# EAGLE design esquematico (EAGLE 9.6.2)
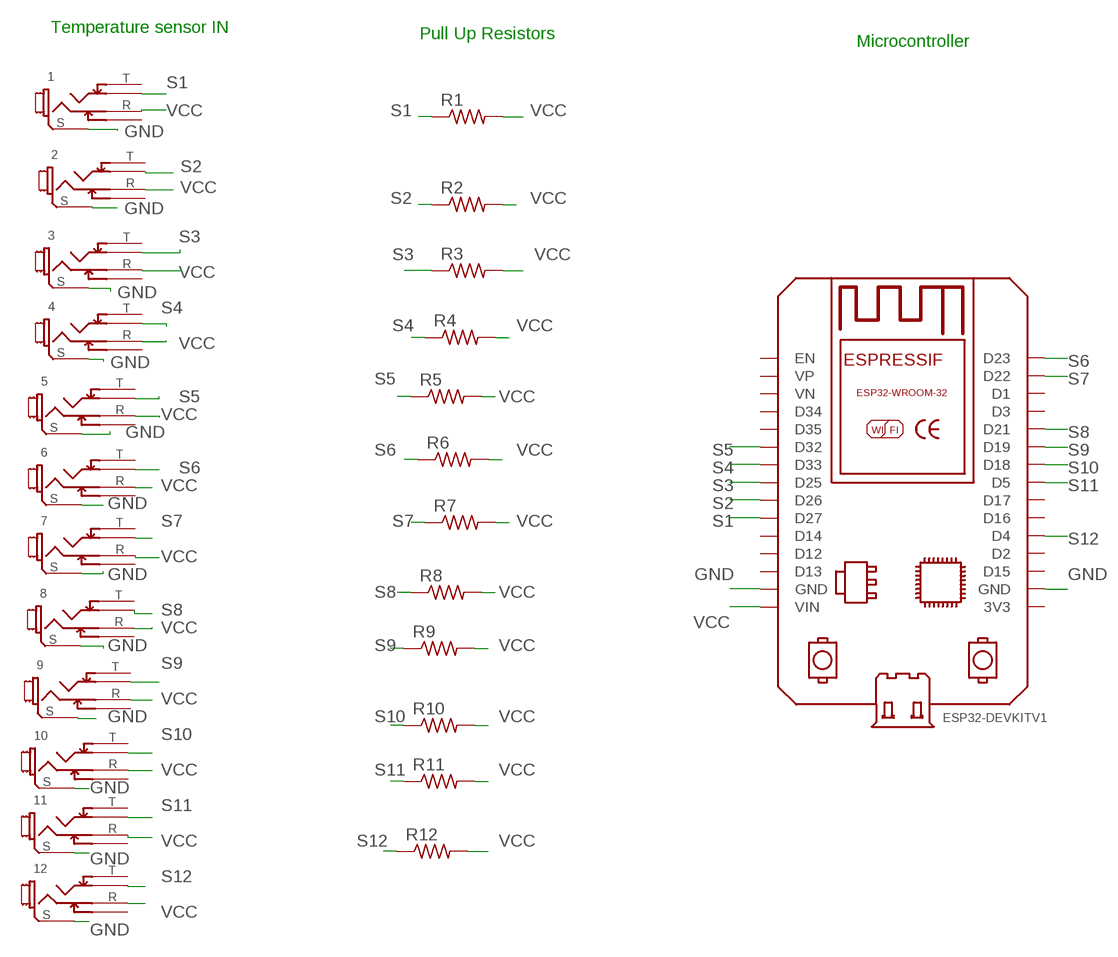
[diagram p0: schematic, sheet 1]

## Parts
1  JACK-3.5MM  [JACK-5PINES]
2  JACK-3.5MM  [JACK-5PINES]
3  JACK-3.5MM  [JACK-5PINES]
4  JACK-3.5MM  [JACK-5PINES]
5  JACK-3.5MM  [JACK-5PINES]
6  JACK-3.5MM  [JACK-5PINES]
7  JACK-3.5MM  [JACK-5PINES]
8  JACK-3.5MM  [JACK-5PINES]
9  JACK-3.5MM  [JACK-5PINES]
10  JACK-3.5MM  [JACK-5PINES]
11  JACK-3.5MM  [JACK-5PINES]
12  JACK-3.5MM  [JACK-5PINES]
BOARD1  ESP32DEVKITV1  [ESP32-DEVKITV1]
R1  R-US_M0805  [M0805]
R2  R-US_M0805  [M0805]
R3  R-US_M0805  [M0805]
R4  R-US_M0805  [M0805]
R5  R-US_M0805  [M0805]
R6  R-US_M0805  [M0805]
R7  R-US_M0805  [M0805]
R8  R-US_M0805  [M0805]
R9  R-US_M0805  [M0805]
R10  R-US_M0805  [M0805]
R11  R-US_M0805  [M0805]
R12  R-US_M0805  [M0805]

## Nets
GND: 1.S 2.S 3.S 4.S 5.S 6.S 7.S 8.S 9.S 10.S 11.S 12.S BOARD1.GND BOARD1.GND@1(GND)
S1: 1.T BOARD1.D27 R1.1
S2: 2.T BOARD1.D26 R2.1
S3: 3.T BOARD1.D25 R3.1
S4: 4.T BOARD1.D33 R4.1
S5: 5.T BOARD1.D32 R5.1
S6: 6.T BOARD1.D23 R6.1
S7: 7.T BOARD1.D22 R7.1
S8: 8.T BOARD1.D21 R8.1
S9: 9.T BOARD1.D19 R9.1
S10: 10.T BOARD1.D18 R10.1
S11: 11.T BOARD1.D5 R11.1
S12: 12.T BOARD1.D4 R12.1
VCC: 1.R 2.R 3.R 4.R 5.R 6.R 7.R 8.R 9.R 10.R 11.R 12.R BOARD1.VIN R1.2 R2.2 R3.2 R4.2 R5.2 R6.2 R7.2 R8.2 R9.2 R10.2 R11.2 R12.2
Unconnected: 1.RS 1.TS 2.RS 2.TS 3.RS 3.TS 4.RS 4.TS 5.RS 5.TS 6.RS 6.TS 7.RS 7.TS 8.RS 8.TS 9.RS 9.TS 10.RS 10.TS 11.RS 11.TS 12.RS 12.TS BOARD1.3V3 BOARD1.D1 BOARD1.D2 BOARD1.D3 BOARD1.D12 BOARD1.D13 BOARD1.D14 BOARD1.D15 BOARD1.D16 BOARD1.D17 BOARD1.D34 BOARD1.D35 BOARD1.EN BOARD1.VN BOARD1.VP

## Notes on the sheet
- Temperature sensor IN
- Pull Up Resistors
- Microcontroller

## Library data of the parts
1-12 = MCE_Conectores:JACK-3.5MM: Jack para audio 3.5mm / 5 pines para PCB
BOARD1 = ESP32-DEVKITV1:ESP32DEVKITV1: https://github.com/shridattdudhat
R1-R12 = rcl:R-US_: RESISTOR, American symbol; SPICEPREFIX: R

## Board
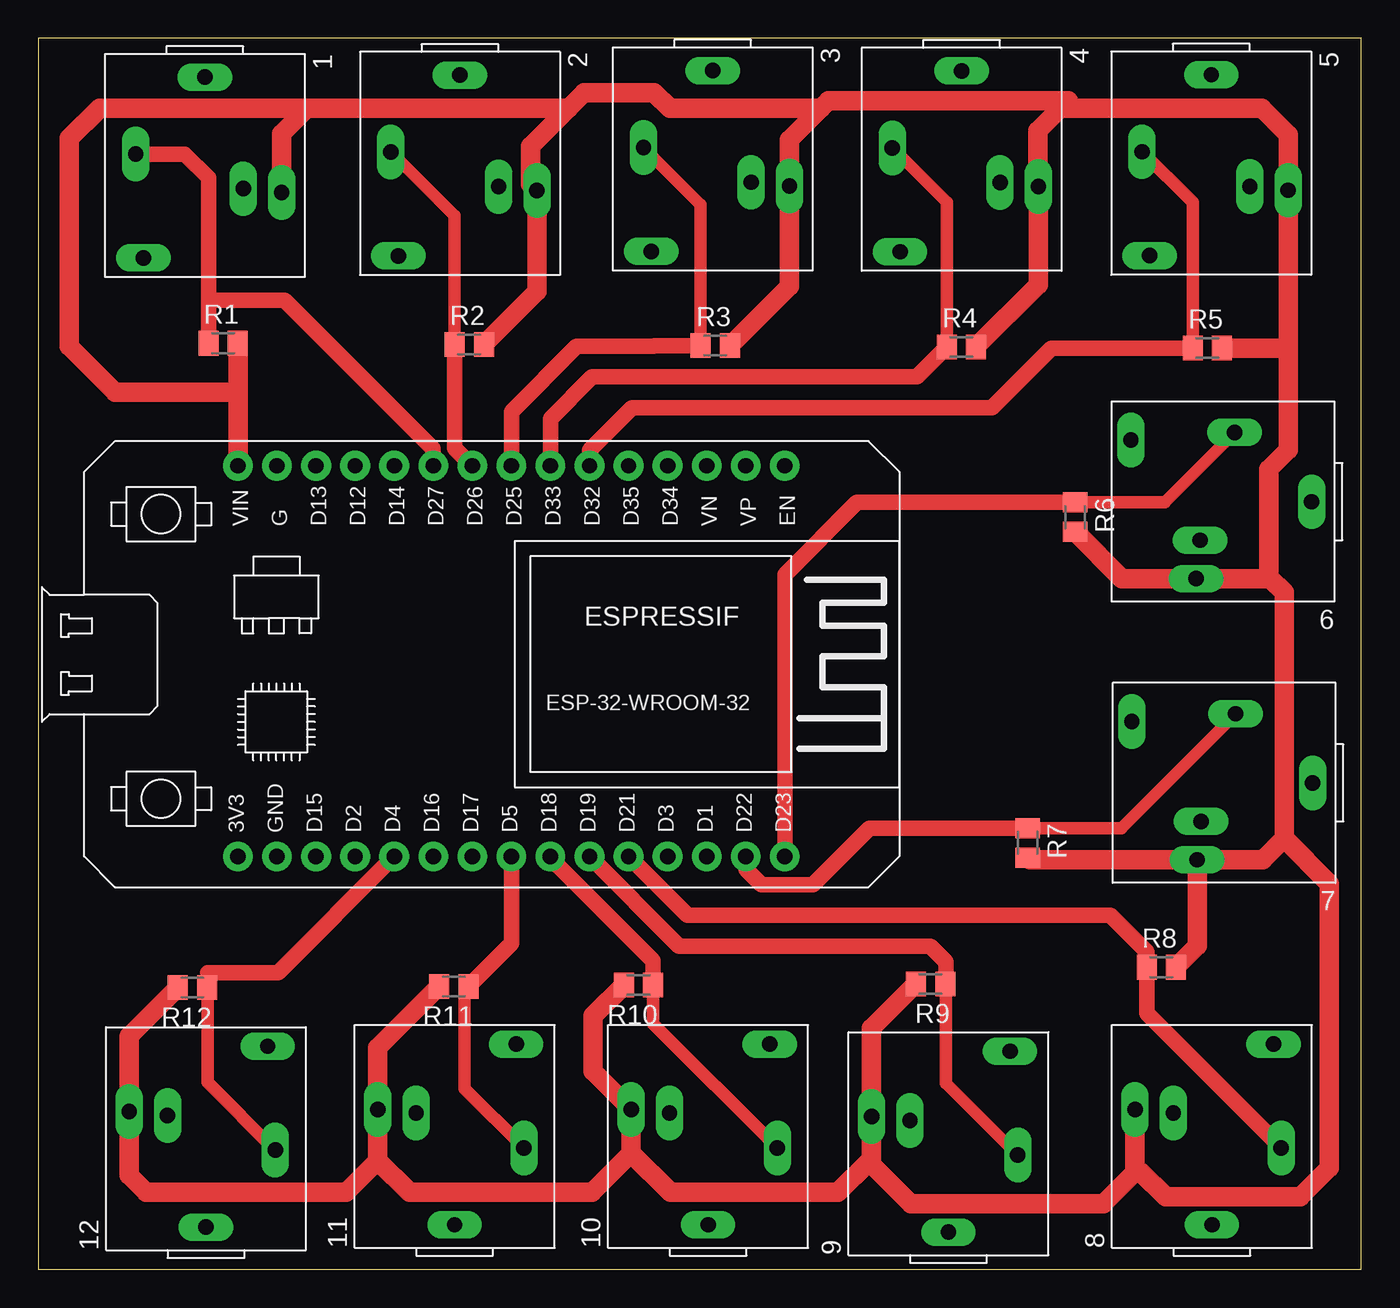
[diagram p1: board, top side]
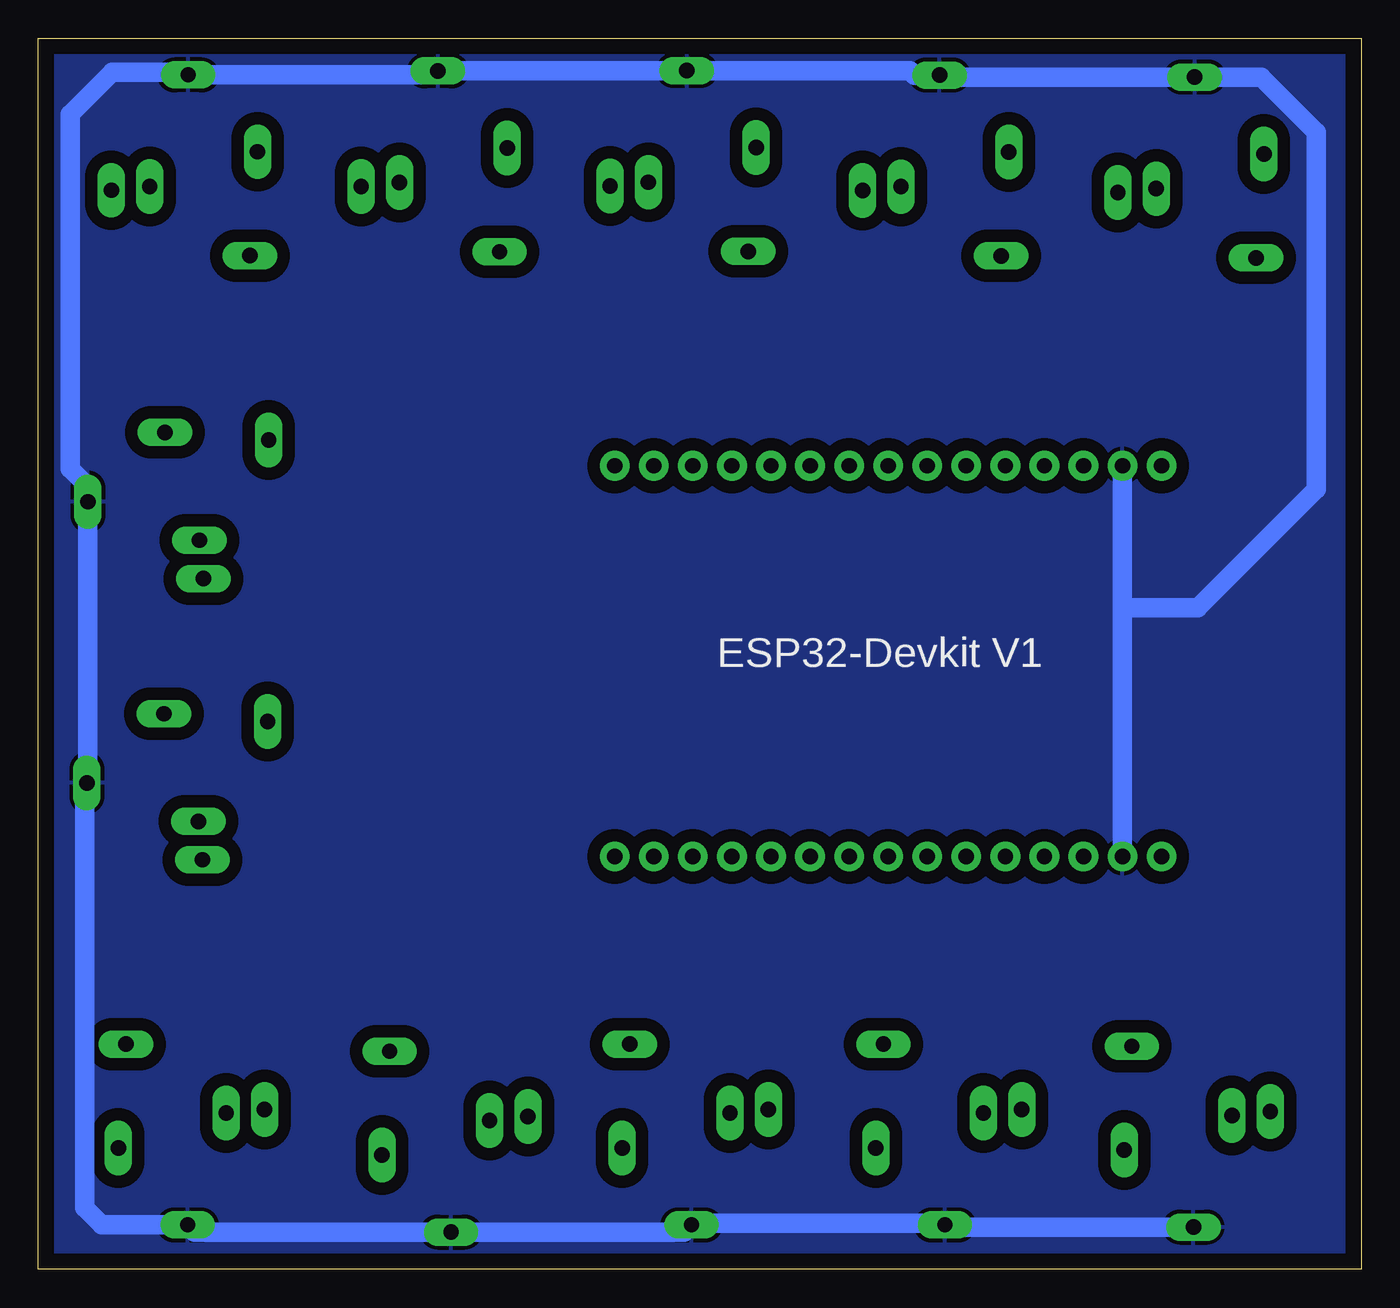
[diagram p2: board, bottom side, seen from below]

Size 86 x 80 mm. Coordinates in mm from the lower left corner, seen from the top.
Outline: 0,0 86,0 86,80 0,80 0,0
Copper layers (1*16): Top 0.035mm / dielectric 1.5mm / Bottom 0.035mm
Design rules "default *": minimum track width 6mil, minimum drill 0.35mm, track to track 10mil, track to pad 10mil, pad to pad 10mil, via to via 10mil, smd to smd 10mil, copper to edge 40mil, drill to drill 6mil, minimum pad ring 10mil, minimum via ring 8mil, stop-mask expansion 4mil, vias tented up to drill 0mil, thermal gap 10mil

### Footprints (pad centres in the part's own frame; a part is rotated, then mirrored left to right if it is on the bottom)
JACK-5PINES = drill 1 pad 1.778 long: R 2.503,4.997; RS 2.254,2.505; S -5,0; T 0,-4.5; TS 6.75,-4
ESP32-DEVKITV1 = drill 1 pad 1.93: 3V3 0,0; D1 30.48,0; D2 7.62,0; D3 27.94,0; D4 10.16,0; D5 17.78,0; D12 7.62,25.4; D13 5.08,25.4; D14 10.16,25.4; D15 5.08,0; D16 12.7,0; D17 15.24,0; D18 20.32,0; D19 22.86,0; D21 25.4,0; D22 33.02,0; D23 35.56,0; D25 17.78,25.4; D26 15.24,25.4; D27 12.7,25.4; D32 22.86,25.4; D33 20.32,25.4; D34 27.94,25.4; D35 25.4,25.4; EN 35.56,25.4; GND 2.54,25.4; GND@1 2.54,0; VIN 0,25.4; VN 30.48,25.4; VP 33.02,25.4
M0805 = smd 1.3 x 1.6: 1 -0.95,0; 2 0.95,0

### Placement (x,y rotation side)
1  10.82,72.49 270 top
2  27.41,72.62 270 top
3  43.84,72.91 270 top
4  60.02,72.89 270 top
5  76.26,72.64 270 top
6  77.78,49.89 180 top
7  77.85,31.61 180 top
8  76.3,7.89 90 top
9  59.17,7.42 90 top
10  43.54,7.89 90 top
11  27.06,7.89 90 top
12  10.9,7.74 90 top
BOARD1  12.97,26.83 0 top
R1  12.01,60.19 0 top
R2  28.01,60.11 0 top
R3  44.01,60.03 0 top
R4  60.01,59.95 0 top
R5  76.01,59.87 0 top
R6  67.41,48.89 270 top
R7  64.31,27.71 270 top
R8  73.01,19.63 0 top
R9  58.01,18.55 180 top
R10  39.01,18.47 180 top
R11  27.01,18.39 180 top
R12  10.01,18.31 180 top

### Tracks (layer width: path | path; a pad name or v marks a point on that pad's centre or on a via)
GND
  Bottom 1.016: 60,77.91 4.S | 44.01,2.42 10.S
  Bottom 1.27: BOARD1.GND 15.51,43 | 15.51,43 BOARD1.GND@1 | 12.S 26.91,2.74 11.S 27.17,3 43.43,3 44.01,2.42 9.S 75.83,2.42 8.S 81.89,2.89 83,4 83,31.46 7.S 82.78,31.68 6.S 82.78,50.89 83.93,52.04 83.93,75.07 81.2,77.8 76.42,77.8 5.S 60.27,77.64 60,77.91 3.S 29.34,77.91 29.05,77.62 2.S 27.28,77.49 1.S 6.49,77.49 2.9,73.9 2.9,50.7 10.6,43 15.51,43
  pour Bottom (isolate 0.813): 0,80 0,0 86,0 86,80
S1
  Top 1.016: 1.T 9.51,72.49 11.06,70.94 11.06,63 | 11.06,63 R1.1 | BOARD1.D27 25.67,53.33 16,63 11.06,63
S2
  Top 0.813: 2.T 27.06,68.47 R2.1
  Top 1.016: BOARD1.D26 27.06,53.38 R2.1
S3
  Top 0.813: 3.T 43.06,69.19 R3.1
  Top 1.016: R3.1 40.06,60.03 40.03,60 35,60 30.75,55.75 BOARD1.D25
S4
  Top 0.813: 4.T 59.06,69.35 R4.1
  Top 1.016: BOARD1.D33 33.29,55.29 36,58 57.11,58 R4.1
S5
  Top 0.813: 5.T 75.06,69.34 R5.1
  Top 1.016: BOARD1.D32 35.83,53.23 38.6,56 62,56 65.87,59.87 R5.1
S6
  Top 0.813: 6.T 73.23,49.84 R6.1
  Top 1.016: R6.1 53.23,49.84 48.53,45.14 BOARD1.D23
S7
  Top 0.813: 7.T 70.4,28.66 R7.1
  Top 1.016: R7.1 54.03,28.66 50.37,25 47,25 45.99,26.01 BOARD1.D22
S8
  Top 1.016: BOARD1.D21 42.2,23 69.69,23 72.06,20.63 R8.1 72.06,16.63 8.T
S9
  Top 0.813: R9.1 59,18.51 59,12.09 9.T
  Top 1.016: BOARD1.D19 41.66,21 58,21 59,20 59,18.51
S10
  Top 0.813: 10.T 39.96,15.97 R10.1
  Top 1.016: BOARD1.D18 33.29,26.71 39.96,20.04 R10.1
S11
  Top 0.813: R11.1 27.72,18.15 27.72,11.73 11.T
  Top 1.016: BOARD1.D5 30.75,21.18 R11.1
S12
  Top 0.813: 12.T 11,12.14 11,18.27 | 11,18.27 R12.1 | 11,18.27 11,19.27
  Top 1.016: BOARD1.D4 15.57,19.27 11,19.27
VCC
  Top 1.27: R12.2 5.9,15.15 12.R 5.9,6.1 7,5 20,5 22.06,7.06 | R11.2 22.06,14.39 11.R 22.06,7.06 | R9.2 54.17,15.66 9.R 54.17,7.17 54,7 | 22.06,7.06 24.13,5 36,5 38.54,7.54 | 38.54,7.54 10.R 36.06,12.88 36.06,16.47 R10.2 | 54,7 52,5 41.09,5 38.54,7.54 | 8.R 71.3,6.3 | 54,7 56.74,4.26 69.25,4.26 71.3,6.3 | 7.R 64.46,26.61 R7.2 | R6.2 70.46,44.89 6.R 80.11,44.89 | 81,28 79.61,26.61 7.R | R4.2 65.02,64.01 4.R 65,70.4 65,74 66.45,75.45 | 66.45,75.45 66.95,75.95 51.38,75.95 50.88,75.45 | R3.2 48.84,63.91 3.R 48.84,73.41 50.88,75.45 | 66.45,75.45 79.55,75.45 81.26,73.74 5.R 81.26,59.87 | R2.2 32.41,63.56 2.R 32,70.52 32,73 34.48,75.47 | 50.88,75.45 41.05,75.45 40.03,76.47 35.48,76.47 34.48,75.47 | 34.48,75.47 17.48,75.47 | 1.R 15.82,73.82 17.48,75.47 | 17.48,75.47 3.98,75.47 2,73.5 2,60 5,57 13,57 | 13,57 13,60.15 R1.2 | BOARD1.VIN 12.97,56.97 13,57 | 71.3,6.3 71.7,6.3 73.3,4.7 82.05,4.7 83.95,6.6 83.95,25.05 81,28 | R8.2 75.35,21.02 7.R | 81.26,59.87 81.26,53.26 80,52 80,45 80.11,44.89 | 80.11,44.89 81,44 81,28 | R5.2 81.26,59.87